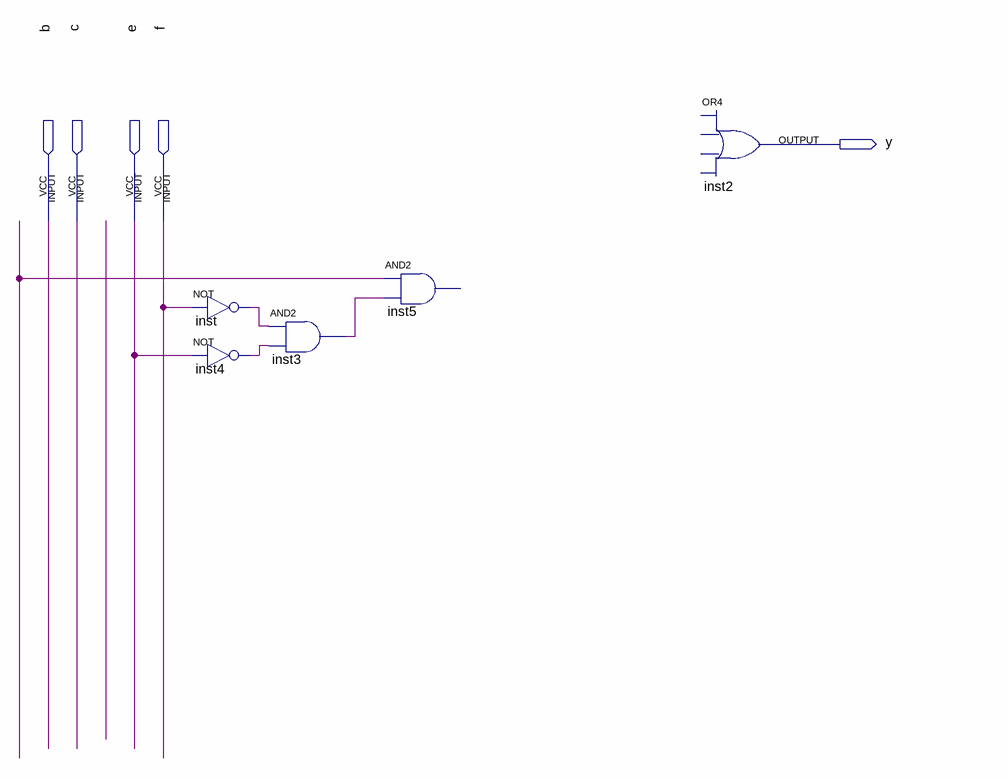
[diagram p0: schematic sheet]
// Quartus schematic hw9p4.bdf as structural Verilog: 5 symbols, 5 pins
module hw9p4 (
  input  b,
  input  c,
  input  e,
  input  f,
  output y
);

  wire inst3_out, inst4_out, inst_out, undriven;

  not inst (inst_out, f);
  not inst4 (inst4_out, e);
  and inst3 (inst3_out, inst_out, inst4_out);
  // AND2 inst5 has open pins: IN1=undriven, IN2=inst3_out, OUT=open
  // OR4 inst2 has open pins: IN1=open, IN2=open, IN3=open, IN4=open, OUT=y
endmodule
